# Altium schematic sheet Memory.SchDoc: SPI Memory Module
size Letter; DocumentNumber: 3; Revision: 1; SheetNumber: 3; SheetTotal: 6
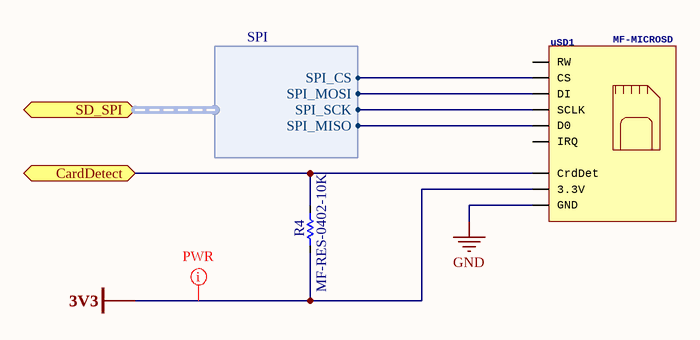
[diagram p0: Memory.SchDoc]

## Parts
R4  MF-RES-0402-10K  [R0402L]
uSD1  MF-MICROSD  [MF-MICROSD]

## Ports
CardDetect, SD_SPI (harness SPI)

## Harnesses
SPI: SPI_CS, SPI_MISO, SPI_MOSI, SPI_SCK

## Nets
3V3: R4.1 uSD1.3.3V
GND: uSD1.GND
CardDetect: R4.2 uSD1.CrdDet ; port CardDetect
NetuSD1_2: uSD1.2(CS) ; port SD_SPI.SPI_CS
NetuSD1_3: uSD1.3(DI) ; port SD_SPI.SPI_MOSI
NetuSD1_5: uSD1.5(SCLK) ; port SD_SPI.SPI_SCK
NetuSD1_7: uSD1.7(D0) ; port SD_SPI.SPI_MISO

Not connected (* = marked no-connect by the designer): uSD1 1(RW) 8(IRQ)

## Layout directives
net class PWR: 3V3

## Notes on the sheet
- Title
- Size:
- Date:
- Letter
- Number:
- Time:
- Revision:
- Sheet
- of
- File:

## Library data of the parts
R4 = RESISTOR: HOUSEPART: YES; POPULATE: 1; VOLTAGE: 50 V; WATTAGE: 100mW; VALUE: 10K; SymbolName_1: RESISTOR; LibraryName: MF_Passives; DeviceSetName: RESISTOR; MF_PARTNUM: MF-RES-0402-10K
uSD1 = MacroFab uSD card slot: HOUSEPART: YES; SymbolName_1: SD_CARD; DeviceName: _MICRO_RIGHT; DeviceSetName: SD_CARD_SLOT; POPULATE: 1; MPN: MF-MICROSD; URL: https://factory.macrofab.com/part/MF-MICROSD